# Altium schematic sheet C8T6.SchDoc
size A4
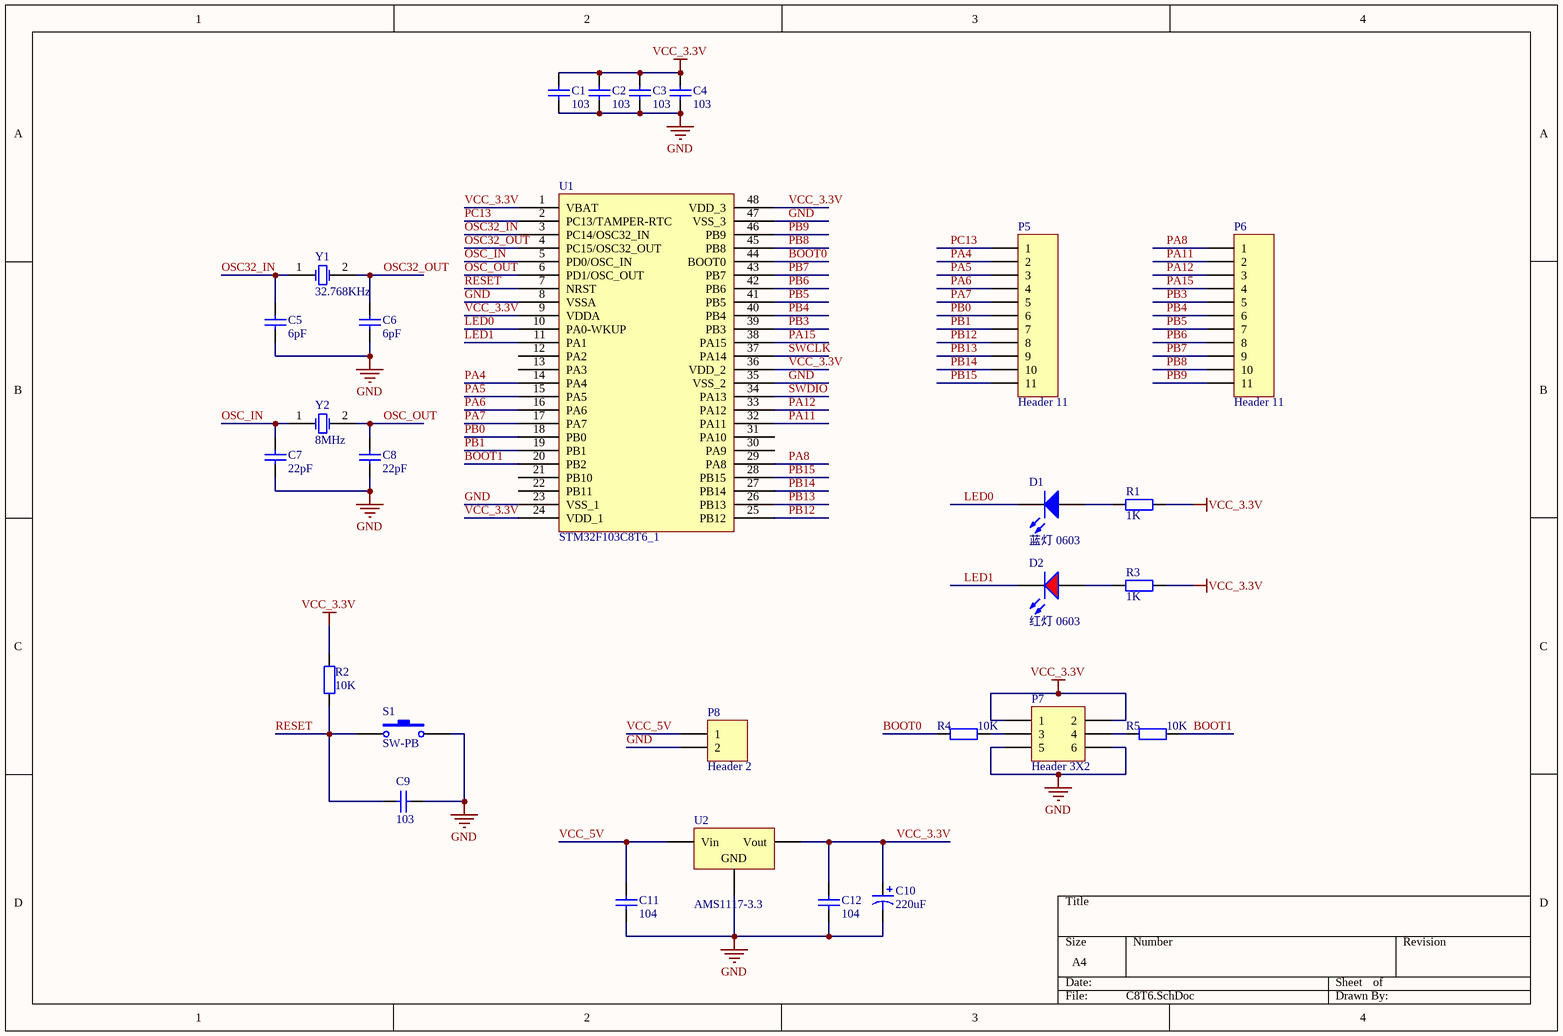
[diagram p0: C8T6.SchDoc]

## Parts
C1  value 103  [C_0603]  (hidden comment: Cap)
C2  value 103  [C_0603]  (hidden comment: Cap)
C3  value 103  [C_0603]  (hidden comment: Cap)
C4  value 103  [C_0603]  (hidden comment: Cap)
C5  value 6pF  [C_0603]  (hidden comment: Cap)
C6  value 6pF  [C_0603]  (hidden comment: Cap)
C7  value 22pF  [C_0603]  (hidden comment: Cap)
C8  value 22pF  [C_0603]  (hidden comment: Cap)
C9  value 103  [C_0603]  (hidden comment: Cap)
C10  value 220uF  [CAP-SMD_BD6.3-L6.6-W6.6-FD]  (hidden comment: Cap Pol1)
C11  value 104  [C_0603]  (hidden comment: Cap)
C12  value 104  [C_0603]  (hidden comment: Cap)
D1  蓝灯 0603  [0603_LED_S1]
D2  红灯 0603  [0603_LED_S1]
P5  Header 11  [HDR2.54-LI-11P]
P6  Header 11  [HDR2.54-LI-11P]
P7  Header 3X2  [HDR2.54-LI-2x3P]
P8  Header 2  [XH2.54-LI-2P]
R1  value 1K  [R_0603]  (hidden comment: Res2)
R2  value 10K  [R_0603]  (hidden comment: Res2)
R3  value 1K  [R_0603]  (hidden comment: Res2)
R4  value 10K  [R_0603]  (hidden comment: Res2)
R5  value 10K  [R_0603]  (hidden comment: Res2)
S1  SW-PB  [TSW SMD-3*6*2.5]
U1  STM32F103C8T6_1  [LQFP48-7*7]
U2  AMS1117-3.3  [SOT-223]
Y1  32.768KHz  [OSC-SMD_L3.2-W1.5]
Y2  8MHz  [OSC-TH_L10.0-W4.5-P5.00]

## Nets
GND: C1.1 C2.1 C3.1 C4.1 C5.1 C6.1 C7.1 C8.1 C9.2 C10.2 C11.1 C12.1 P7.5 P7.6 P8.2 S1.2 U1.8(VSSA) U1.23(VSS_1) U1.35(VSS_2) U1.47(VSS_3) U2.1(GND)
VCC_3.3V: C1.2 C2.2 C3.2 C4.2 C10.1 C12.2 P7.1 P7.2 R1.2 R2.2 R3.2 U1.1(VBAT) U1.9(VDDA) U1.24(VDD_1) U1.36(VDD_2) U1.48(VDD_3) U2.2(Vout)
BOOT0: R4.1 U1.44(BOOT0)
BOOT1: R5.2 U1.20(PB2)
LED0: D1.K U1.10(PA0-WKUP)
LED1: D2.K U1.11(PA1)
OSC32_IN: C5.2 U1.3(PC14/OSC32_IN) Y1.1(OSC1)
OSC32_OUT: C6.2 U1.4(PC15/OSC32_OUT) Y1.2(OSC2)
OSC_IN: C7.2 U1.5(PD0/OSC_IN) Y2.1(OSC1)
OSC_OUT: C8.2 U1.6(PD1/OSC_OUT) Y2.2(OSC2)
PA4: P5.2 U1.14(PA4)
PA5: P5.3 U1.15(PA5)
PA6: P5.4 U1.16(PA6)
PA7: P5.5 U1.17(PA7)
PA8: P6.1 U1.29(PA8)
PA11: P6.2 U1.32(PA11)
PA12: P6.3 U1.33(PA12)
PA15: P6.4 U1.38(PA15)
PB0: P5.6 U1.18(PB0)
PB1: P5.7 U1.19(PB1)
PB3: P6.5 U1.39(PB3)
PB4: P6.6 U1.40(PB4)
PB5: P6.7 U1.41(PB5)
PB6: P6.8 U1.42(PB6)
PB7: P6.9 U1.43(PB7)
PB8: P6.10 U1.45(PB8)
PB9: P6.11 U1.46(PB9)
PB12: P5.8 U1.25(PB12)
PB13: P5.9 U1.26(PB13)
PB14: P5.10 U1.27(PB14)
PB15: P5.11 U1.28(PB15)
PC13: P5.1 U1.2(PC13/TAMPER-RTC)
RESET: C9.1 R2.1 S1.1 U1.7(NRST)
SWCLK: U1.37(PA14)
SWDIO: U1.34(PA13)
VCC_5V: C11.2 P8.1 U2.3(Vin)
NetD1_A: D1.A R1.1
NetD2_A: D2.A R3.1
NetP7_3: P7.3 R4.2
NetP7_4: P7.4 R5.1

Not connected (* = marked no-connect by the designer): U1 12(PA2) 13(PA3) 21(PB10) 22(PB11) 30(PA9) 31(PA10)

## Library data of the parts
C1-C9 C11 C12 = Cap: Capacitor; Published: 8-Jun-2000; LatestRevisionDate: 17-Jul-2002; LatestRevisionNote: Re-released for DXP Platform.; PackageReference: RAD-0.3; Publisher: Altium Limited; PackageDescription: Radial Cap, Thru-Hole; 2 Leads; 0.3 in Pin Spacing
C10 = Cap Pol1: Polarized Capacitor (Radial); Published: 8-Jun-2000; LatestRevisionDate: 17-Jul-2002; LatestRevisionNote: Re-released for DXP Platform.; PackageReference: RB7.6-15; Publisher: Altium Limited; PackageDescription: Polarized Capacitor (Radial); 2 Leads
D1 = 0603 蓝灯: 发光二极管; ComponentLink1Description: 供应商链接; ComponentLink1URL: http://www.szlcsc.com/product/details_73150.html; Package: 0603; Supplier: LC; SuppliersPartNumber: C72041
D2 = 0603 红灯: 发光二极管; ComponentLink1Description: 供应商链接; ComponentLink1URL: http://www.szlcsc.com/product/details_2659.html; Package: 0603; Supplier: LC; SuppliersPartNumber: C2286
P5 P6 = Header 11: Header, 11-Pin; LatestRevisionDate: 17-Jul-2002; LatestRevisionNote: Re-released for DXP Platform.; Publisher: Altium Limited
P7 = Header 3X2: Header, 3-Pin, Dual row; LatestRevisionDate: 17-Jul-2002; LatestRevisionNote: Re-released for DXP Platform.; Publisher: Altium Limited
P8 = Header 2: Header, 2-Pin; LatestRevisionDate: 17-Jul-2002; LatestRevisionNote: Re-released for DXP Platform.; Publisher: Altium Limited
R1-R5 = Res2: Resistor; Published: 8-Jun-2000; LatestRevisionDate: 17-Jul-2002; LatestRevisionNote: Re-released for DXP Platform.; PackageReference: AXIAL-0.4; Publisher: Altium Limited; PackageDescription: Axial Device, Thru-Hole; 2 Leads; 0.4 in Pin Spacing
S1 = SW-PB: Switch; Published: 24-Mar-1999; LatestRevisionDate: 17-Jul-2002; LatestRevisionNote: Re-released for DXP Platform.; PackageReference: SPST-2; Publisher: Altium Limited; PackageDescription: Switch; 2 Leads
U2 = SOT-223 AMS1117-3.3: 低压差线性稳压(LDO); ComponentLink1Description: 供应商链接; ComponentLink1URL: http://www.szlcsc.com/product/details_6652.html; Package: SOT-223; Supplier: LC; SuppliersPartNumber: C6186
Y1 Y2 = XTAL: Crystal Oscillator; Published: 8-Jun-2000; LatestRevisionDate: 17-Jul-2002; LatestRevisionNote: Re-released for DXP Platform.; PackageReference: R38; Publisher: Altium Limited; PackageDescription: Crystal, Thru-Hole; 2 Leads; Body 3.1 x 8.2 mm (Dia.xH)